# EAGLE design boarduino_clone (EAGLE 9.5.2)
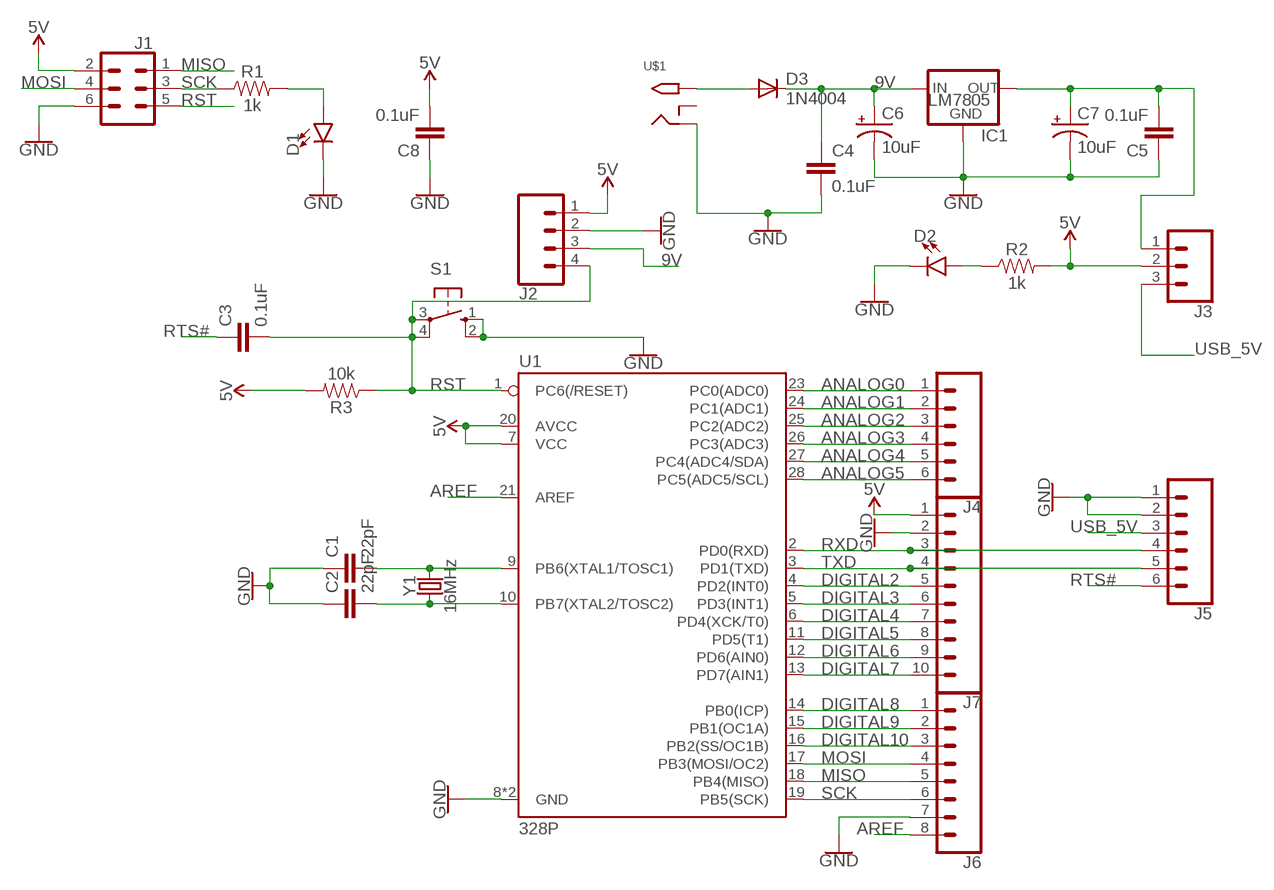
[diagram p0: schematic, sheet 1]

## Parts
C1  22pF  22PF-PTH-2.54MM-200V-5%  [CAP-PTH-2.54]
C2  22pF  22PF-PTH-2.54MM-200V-5%  [CAP-PTH-2.54]
C3  0.1uF  0.1UF-KIT-EZ-50V-20%  [CAP-PTH-SMALL-KIT]
C4  0.1uF  0.1UF-KIT-EZ-50V-20%  [CAP-PTH-SMALL-KIT]
C5  0.1uF  0.1UF-KIT-EZ-50V-20%  [CAP-PTH-SMALL-KIT]
C6  10uF  10UF-POLAR-RADIAL-2.5MM-25V-20%  [CPOL-RADIAL-2.5MM-5MM]
C7  10uF  10UF-POLAR-RADIAL-2.5MM-25V-20%  [CPOL-RADIAL-2.5MM-5MM]
C8  0.1uF  0.1UF-KIT-EZ-50V-20%  [CAP-PTH-SMALL-KIT]
D1  LED5MM  [LED_5MM]
D2  LED5MM  [LED_5MM]
D3  1N4004  [DO41-10]
IC1  LM7805  78XXS  [78XXS]
J1  FEMALE 2x3  CONN_03X2FEMALE  [2X3]
J2  CONN_041X04_NO_SILK  [1X04_NO_SILK]
J3  CONN_031X03_NO_SILK  [1X03_NO_SILK]
J4  CONN_06NO_SILK_FEMALE_PTH  [1X06_NO_SILK]
J5  CONN_06NO_SILK_FEMALE_PTH  [1X06_NO_SILK]
J6  CONN_08NO_SILK_FEMALE_PTH  [1X08_NO_SILK]
J7  CONN_10NO_SILK_PTH_FEMALE  [1X10_NO_SILK]
R1  1k  1KOHM-VERT-1/4W-5%  [AXIAL-0.1]
R2  1k  1KOHM-VERT-1/4W-5%  [AXIAL-0.1]
R3  10k  10KOHM-VERT-1/4W-5%  [AXIAL-0.1]
S1  10-XX  [B3F-10XX]
U1  328P  ATMEGA328P_PDIP  [DIP28]
U$1  2.1MMJACKTHM  [PJ-102A]
Y1  16MHz  CRYSTAL-16MHZPTH-HC49US  [HC49US]

## Nets
5V: C8.2 J1.2 J2.1 J3.2 J7.1 R2.P$2 R3.P$2 U1.7(VCC) U1.20(AVCC)
9V: C4.1 C6.1(+) D3.C IC1.IN J2.3
ANALOG0: J4.1 U1.23(PC0(ADC0))
ANALOG1: J4.2 U1.24(PC1(ADC1))
ANALOG2: J4.3 U1.25(PC2(ADC2))
ANALOG3: J4.4 U1.26(PC3(ADC3))
ANALOG4: J4.5 U1.27(PC4(ADC4/SDA))
ANALOG5: J4.6 U1.28(PC5(ADC5/SCL))
AREF: J6.8 U1.21(AREF)
DIGITAL2: J7.5 U1.4(PD2(INT0))
DIGITAL3: J7.6 U1.5(PD3(INT1))
DIGITAL4: J7.7 U1.6(PD4(XCK/T0))
DIGITAL5: J7.8 U1.11(PD5(T1))
DIGITAL6: J7.9 U1.12(PD6(AIN0))
DIGITAL7: J7.10 U1.13(PD7(AIN1))
DIGITAL8: J6.1 U1.14(PB0(ICP))
DIGITAL9: J6.2 U1.15(PB1(OC1A))
DIGITAL10: J6.3 U1.16(PB2(SS/OC1B))
GND: C1.1 C2.1 C4.2 C5.1 C6.2(-) C7.2(-) C8.1 D1.K(C) D2.K(C) IC1.GND J1.6 J2.2 J5.1 J5.2 J6.7 J7.2 S1.1(S) S1.2(S1) U1.8(GND) U1.22(GND) U$1.RING
MISO: J1.1 J6.5 U1.18(PB4(MISO))
MOSI: J1.4 J6.4 U1.17(PB3(MOSI/OC2))
N$6: D1.A R1.P$2
N$12: C1.2 U1.9(PB6(XTAL1/TOSC1)) Y1.2
N$13: C2.2 U1.10(PB7(XTAL2/TOSC2)) Y1.1
N$36: D3.A U$1.TIP
N$40: C5.2 C7.1(+) IC1.OUT J3.1
N$46: D2.A R2.P$1
RST: C3.2 J1.5 J2.4 R3.P$1 S1.3(P) S1.4(P1) U1.1(PC6(/RESET))
RTS#: C3.1 J5.6
RXD: J5.4 J7.3 U1.2(PD0(RXD))
SCK: J1.3 J6.6 R1.P$1 U1.19(PB5(SCK))
TXD: J5.5 J7.4 U1.3(PD1(TXD))
USB_5V: J3.3 J5.3
Unconnected: U$1.RING_SW

## Library data of the parts
C1 C2 = SparkFun-Capacitors:22PF: 22pF ceramic capacitors A capacitor is a passive two-terminal electrical component used to store electrical energy temporarily in an electric field.; PROD_ID: CAP-09128
C3-C5 C8 = SparkFun-Capacitors:0.1UF: 0.1µF ceramic capacitors A capacitor is a passive two-terminal electrical component used to store electrical energy temporarily in an electric field.; PROD_ID: CAP-08370
C6 C7 = SparkFun-Capacitors:10UF-POLAR: 10.0µF polarized capacitors A capacitor is a passive two-terminal electrical component used to store electrical energy temporarily in an electric field.; PROD_ID: CAP-08440
D1 D2 = SparkFun-LED:LED: LED (Generic) Standard schematic elements and footprints for 5mm, 3mm, 1206, and 0603 sized LEDs. Generic LEDs with no color specified.
D3 = adafruit:1N4004: DIODE General purpose 1N400x type rectifier (With bigger pads) http://www.ladyada.net/library/pcb/eaglelibrary.html
IC1 = v-reg:78XXS: VOLTAGE REGULATOR
J1 = SparkFun-Connectors:CONN_03X2: Multi connection point. Often used as Generic Header-pin footprint for 0.1 inch spaced/style header connections You can populate with any combo of single row headers, but if you'd like an exact match, check these: Header - 2x3 (Male, 0.1") <https://www.sparkfun.com/products/12807> (PRT-12807) Header - 2x3 (Female, 0.1") <https://www.sparkfun.com/products/13010> (PRT-13010) 2x3 Pin Shrouded Header <https://www.sparkfun.com/products/10877> (PRT-10877) On any of the 0.1 inch spaced packages, you can populate with these: Break Away Headers - Straight <https://www.sparkfun.com/products/116> (PRT-00116) Break Away Male Headers - Right Angle <https://www.sparkfun.com/products/553> (PRT-00553) Female Headers <https://www.sparkfun.com/products/115> (PRT-00115) Break Away Headers - Machine Pin <https://www.sparkfun.com/products/117> (PRT-00117) Break Away Female Headers - Swiss Machine Pin <https://www.sparkfun.com/products/743> (PRT-00743) Special note: the shrouded connector mates well with our 3x2 ribbon cables: Ribbon Crimp Connector - 6-pin (2x3, Female) <https://www.sparkfun.com/products/10651> (PRT-10651) Ribbon Cable - 6 wire (15ft) <https://www.sparkfun.com/products/10646> (PRT-10646); PROD_ID: CONN-11566
J2 = SparkFun-Connectors:CONN_04: Multi connection point. Often used as Generic Header-pin footprint for 0.1 inch spaced/style header connections On any of the 0.1 inch spaced packages, you can populate with these: Break Away Headers - Straight <https://www.sparkfun.com/products/116> (PRT-00116) Break Away Male Headers - Right Angle <https://www.sparkfun.com/products/553> (PRT-00553) Female Headers <https://www.sparkfun.com/products/115> (PRT-00115) Break Away Headers - Machine Pin <https://www.sparkfun.com/products/117> (PRT-00117) Break Away Female Headers - Swiss Machine Pin <https://www.sparkfun.com/products/743> (PRT-00743) For SCREWTERMINALS and SPRING TERMINALS visit here: Screw Terimnals on SparkFun.com <https://www.sparkfun.com/search/results?term=Screw+Terminals> (5mm/3.5mm/2.54mm spacing) This device is also useful as a general connection point to wire up your design to another part of your project. Our various solder wires solder well into these plated through hole pads. Hook-Up Wire - Assortment (Stranded, 22 AWG) <https://www.sparkfun.com/products/11375> (PRT-11375) Hook-Up Wire - Assortment (Solid Core, 22 AWG) <https://www.sparkfun.com/products/11367> (PRT-11367) View the entire wire category on our website here <https://www.sparkfun.com/categories/141> Special notes: Molex polarized connector foot print use with SKU : PRT-08231 with associated crimp pins and housings. 1MM SMD Version SKU: PRT-10208; PROD_ID: CONN-09696
J3 = SparkFun-Connectors:CONN_03: Multi connection point. Often used as Generic Header-pin footprint for 0.1 inch spaced/style header connections On any of the 0.1 inch spaced packages, you can populate with these: Break Away Headers - Straight <https://www.sparkfun.com/products/116> (PRT-00116) Break Away Male Headers - Right Angle <https://www.sparkfun.com/products/553> (PRT-00553) Female Headers <https://www.sparkfun.com/products/115> (PRT-00115) Break Away Headers - Machine Pin <https://www.sparkfun.com/products/117> (PRT-00117) Break Away Female Headers - Swiss Machine Pin <https://www.sparkfun.com/products/743> (PRT-00743) Stackable Header - 3 Pin (Female, 0.1") <https://www.sparkfun.com/products/13875> (PRT-13875) For SCREWTERMINALS and SPRING TERMINALS visit here: Screw Terimnals on SparkFun.com <https://www.sparkfun.com/search/results?term=Screw+Terminals> (5mm/3.5mm/2.54mm spacing) This device is also useful as a general connection point to wire up your design to another part of your project. Our various solder wires solder well into these plated through hole pads. Hook-Up Wire - Assortment (Stranded, 22 AWG) <https://www.sparkfun.com/products/11375> (PRT-11375) Hook-Up Wire - Assortment (Solid Core, 22 AWG) <https://www.sparkfun.com/products/11367> (PRT-11367) View the entire wire category on our website here <https://www.sparkfun.com/categories/141> Special notes: Molex polarized connector foot print use with SKU : PRT-08232 with associated crimp pins and housings.
J4 J5 = SparkFun-Connectors:CONN_06: Multi connection point. Often used as Generic Header-pin footprint for 0.1 inch spaced/style header connections On any of the 0.1 inch spaced packages, you can populate with these: Break Away Headers - Straight <https://www.sparkfun.com/products/116> (PRT-00116) Break Away Male Headers - Right Angle <https://www.sparkfun.com/products/553> (PRT-00553) Female Headers <https://www.sparkfun.com/products/115> (PRT-00115) Break Away Headers - Machine Pin <https://www.sparkfun.com/products/117> (PRT-00117) Break Away Female Headers - Swiss Machine Pin <https://www.sparkfun.com/products/743> (PRT-00743) Arduino Stackable Header - 6 Pin <https://www.sparkfun.com/products/9280> (PRT-09280) For SCREWTERMINALS and SPRING TERMINALS visit here: Screw Terimnals on SparkFun.com <https://www.sparkfun.com/search/results?term=Screw+Terminals> (5mm/3.5mm/2.54mm spacing) This device is also useful as a general connection point to wire up your design to another part of your project. Our various solder wires solder well into these plated through hole pads. Hook-Up Wire - Assortment (Stranded, 22 AWG) <https://www.sparkfun.com/products/11375> (PRT-11375) Hook-Up Wire - Assortment (Solid Core, 22 AWG) <https://www.sparkfun.com/products/11367> (PRT-11367) View the entire wire category on our website here <https://www.sparkfun.com/categories/141>; PROD_ID: CONN-08437
J6 = SparkFun-Connectors:CONN_08: Multi connection point. Often used as Generic Header-pin footprint for 0.1 inch spaced/style header connections On any of the 0.1 inch spaced packages, you can populate with these: Break Away Headers - Straight <https://www.sparkfun.com/products/116> (PRT-00116) Break Away Male Headers - Right Angle <https://www.sparkfun.com/products/553> (PRT-00553) Female Headers <https://www.sparkfun.com/products/115> (PRT-00115) Break Away Headers - Machine Pin <https://www.sparkfun.com/products/117> (PRT-00117) Break Away Female Headers - Swiss Machine Pin <https://www.sparkfun.com/products/743> (PRT-00743) Arduino Stackable Header - 8 Pin <https://www.sparkfun.com/products/9279> (PRT-09279) For SCREWTERMINALS and SPRING TERMINALS visit here: Screw Terimnals on SparkFun.com <https://www.sparkfun.com/search/results?term=Screw+Terminals> (5mm/3.5mm/2.54mm spacing) This device is also useful as a general connection point to wire up your design to another part of your project. Our various solder wires solder well into these plated through hole pads. Hook-Up Wire - Assortment (Stranded, 22 AWG) <https://www.sparkfun.com/products/11375> (PRT-11375) Hook-Up Wire - Assortment (Solid Core, 22 AWG) <https://www.sparkfun.com/products/11367> (PRT-11367) View the entire wire category on our website here <https://www.sparkfun.com/categories/141> Special notes: Molex polarized connector foot print use with SKU : PRT-08231 with associated crimp pins and housings. 1MM SMD Version SKU: PRT-10208 NOTES ON THE VARIANTS LOCK and LOCK_LONGPADS... This footprint was designed to help hold the alignment of a through-hole component (i.e. 6-pin header) while soldering it into place. You may notice that each hole has been shifted either up or down by 0.005 of an inch from it's more standard position (which is a perfectly straight line). This slight alteration caused the pins (the squares in the middle) to touch the edges of the holes. Because they are alternating, it causes a "brace" to hold the component in place. 0.005 has proven to be the perfect amount of "off-center" position when using our standard breakaway headers. Although looks a little odd when you look at the bare footprint, once you have a header in there, the alteration is very hard to notice. Also,if you push a header all the way into place, it is covered up entirely on the bottom side.; PROD_ID: CONN-08438
J7 = SparkFun-Connectors:CONN_10: Multi connection point. Often used as Generic Header-pin footprint for 0.1 inch spaced/style header connections On any of the 0.1 inch spaced packages, you can populate with these: Break Away Headers - Straight <https://www.sparkfun.com/products/116> (PRT-00116) Break Away Male Headers - Right Angle <https://www.sparkfun.com/products/553> (PRT-00553) Female Headers <https://www.sparkfun.com/products/115> (PRT-00115) Break Away Headers - Machine Pin <https://www.sparkfun.com/products/117> (PRT-00117) Break Away Female Headers - Swiss Machine Pin <https://www.sparkfun.com/products/743> (PRT-00743) Arduino Stackable Header - 10 Pin <https://www.sparkfun.com/products/11376> (PRT-11376) For SCREWTERMINALS and SPRING TERMINALS visit here: Screw Terimnals on SparkFun.com <https://www.sparkfun.com/search/results?term=Screw+Terminals> (5mm/3.5mm/2.54mm spacing) This device is also useful as a general connection point to wire up your design to another part of your project. Our various solder wires solder well into these plated through hole pads. Hook-Up Wire - Assortment (Stranded, 22 AWG) <https://www.sparkfun.com/products/11375> (PRT-11375) Hook-Up Wire - Assortment (Solid Core, 22 AWG) <https://www.sparkfun.com/products/11367> (PRT-11367) View the entire wire category on our website here <https://www.sparkfun.com/categories/141> Special notes: Molex polarized connector foot print use with SKU : PRT-08231 with associated crimp pins and housings. 1MM SMD Version SKU: PRT-10208 NOTES ON THE VARIANTS LOCK and LOCK_LONGPADS... This footprint was designed to help hold the alignment of a through-hole component (i.e. 6-pin header) while soldering it into place. You may notice that each hole has been shifted either up or down by 0.005 of an inch from it's more standard position (which is a perfectly straight line). This slight alteration caused the pins (the squares in the middle) to touch the edges of the holes. Because they are alternating, it causes a "brace" to hold the component in place. 0.005 has proven to be the perfect amount of "off-center" position when using our standard breakaway headers. Although looks a little odd when you look at the bare footprint, once you have a header in there, the alteration is very hard to notice. Also,if you push a header all the way into place, it is covered up entirely on the bottom side.
R1 R2 = SparkFun-Resistors:1KOHM: 1kΩ resistor A resistor is a passive two-terminal electrical component that implements electrical resistance as a circuit element. Resistors act to reduce current flow, and, at the same time, act to lower voltage levels within circuits. - Wikipedia; PROD_ID: RES-08380
R3 = SparkFun-Resistors:10KOHM: 10kΩ resistor A resistor is a passive two-terminal electrical component that implements electrical resistance as a circuit element. Resistors act to reduce current flow, and, at the same time, act to lower voltage levels within circuits. - Wikipedia; PROD_ID: RES-09435
S1 = switch-omron:10-XX: OMRON SWITCH; MPN: B3F-1000; OC_FARNELL: 176432; OC_NEWARK: 36M3542
U1 = SparkFun-IC-Microcontroller:ATMEGA328P_PDIP: Atmel 328P Through hole ATMEGA328P uC used in the Arduino 32kb flash, 1k EEPROM, 2k SRAM Datasheet <http://www.sparkfun.com/datasheets/Components/SMD/ATMega328.pdf> SparkFun Products Storefront component: AVR 28 Pin 20MHz 32K 6A/D - ATMega328P <https://www.sparkfun.com/products/9061> (COM-09061) SparkFun Simon Says - Through-Hole Soldering Kit <https://www.sparkfun.com/products/10547> (KIT-10547) SparkFun Learn to Solder - Simon Says <https://www.sparkfun.com/products/13708> (KIT-13708) SparkFun BigTime Watch Kit <https://www.sparkfun.com/products/11734> (KIT-11734) SparkFun ClockIt <https://www.sparkfun.com/products/10930> (KIT-10930) SparkFun Serial Enabled LCD Kit <https://www.sparkfun.com/products/10097> (LCD-10097) SparkFun Simon Tilts - Through Hole Soldering Kit <https://www.sparkfun.com/products/12634> (KIT-12634) SparkFun Frequency Counter Kit <https://www.sparkfun.com/products/10140> (KIT-10140) FabFM Radio Kit <https://www.sparkfun.com/products/11043> (KIT-11043) SparkFun Binary Blaster Kit <https://www.sparkfun.com/products/12037> (KIT-12037) SparkFun Metro-Gnome <https://www.sparkfun.com/products/9236> (KIT-09236) ATmega328 with Arduino Optiboot (Uno) <https://www.sparkfun.com/products/10524> (DEV-10524); PROD_ID: IC-09136
U$1 = adafruit:2.1MMJACK: 2.1mm x 5.5mm THM DC jack with internal switch. Digikey part #PJ-102A, 4UCON part #05537 2.1mm x 5.5mm SMT DC jack with internal switch. Digikey part #PJ-002A-SMT, 4UCON part #03267 By microbuilder.eu & adafruit.com
Y1 = SparkFun-Clocks:CRYSTAL-16MHZ: 16MHz Crystal Digikey Example <http://www.digikey.com/product-search/en?keywords=535-9122-1-ND> Frequency: 16MHz Frequency Stability: ±50ppm Frequency Tolerance: ±20ppm Load Capacitance: 18pF SparkFun Products: Pro Micro -5V/16MHz <https://www.sparkfun.com/products/12640> SparkFun Serial Enabled LCD Kit <https://www.sparkfun.com/products/10097>; PROD_ID: XTAL-08181; SF_ID: COM-00536

## Board
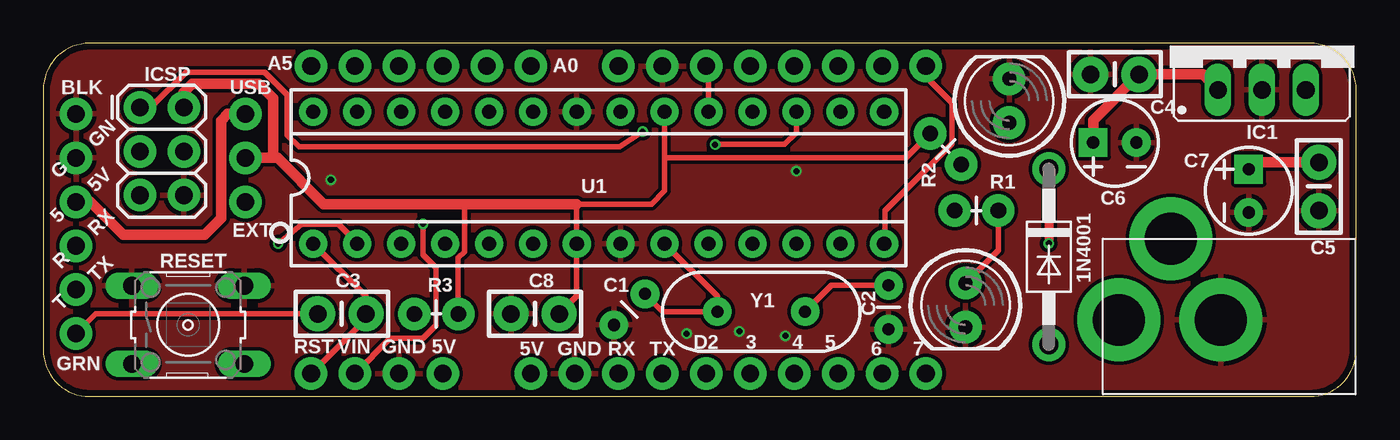
[diagram p1: board, top side]
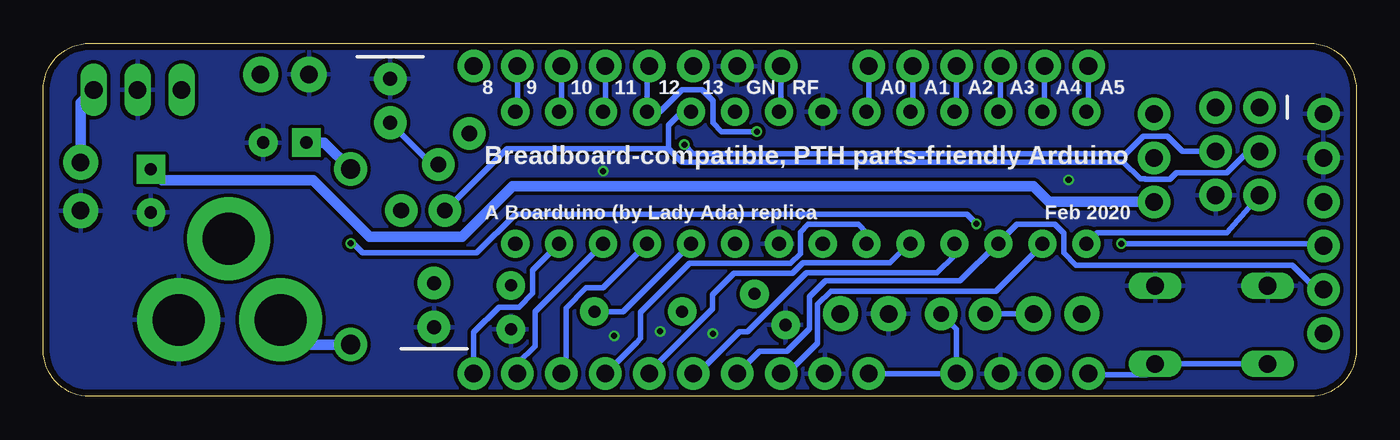
[diagram p2: board, bottom side, seen from below]

Size 75.95 x 20.42 mm. Coordinates in mm from the lower left corner, seen from the top.
Outline: 2.68,0 73.27,0 arc90 75.95,2.68 75.95,17.74 arc90 73.27,20.42 2.68,20.42 arc90 0,17.74 0,2.68 arc90 2.68,0
Copper layers (1*16): Top 0.035559375mm / dielectric 1.6mm / Bottom 0.035559375mm
Design rules "oshpark-2layer": minimum track width 6mil, minimum drill 10mil, track to track 6mil, track to pad 6mil, pad to pad 6mil, via to via 6mil, smd to smd 6mil, copper to edge 15mil, drill to drill 6mil, minimum pad ring 5mil, minimum via ring 5mil, stop-mask expansion 2.5mil, vias tented up to drill 0mil, thermal gap 10mil

### Footprints (pad centres in the part's own frame; a part is rotated, then mirrored left to right if it is on the bottom)
CAP-PTH-2.54 = drill 0.7 pad 1.651: 1 -1.27,0; 2 1.27,0
CAP-PTH-SMALL-KIT = drill 1.016 pad 2.032: 1 -1.397,0; 2 1.397,0
CPOL-RADIAL-2.5MM-5MM = drill 0.7 pad 1.651 square: 1 1.25,0 | drill 0.7 pad 1.651: 2 -1.25,0
LED_5MM = drill 0.813 pad 1.88: A -1.27,0; K 1.27,0
DO41-10 = drill 1.118 pad 1.93: A 5.08,0; C -5.08,0
78XXS = drill 1.016 long: GND 0,-2.54; IN -2.54,-2.54; OUT 2.54,-2.54
2X3 = drill 1.016 pad 1.88: 1 0,0; 2 0,2.54; 3 2.54,0; 4 2.54,2.54; 5 5.08,0; 6 5.08,2.54
1X04_NO_SILK = drill 1.016 pad 1.88: 1 0,0; 2 2.54,0; 3 5.08,0; 4 7.62,0
1X03_NO_SILK = drill 1.016 pad 1.88: 1 0,0; 2 2.54,0; 3 5.08,0
1X06_NO_SILK = drill 1.016 pad 1.88: 1 0,0; 2 2.54,0; 3 5.08,0; 4 7.62,0; 5 10.16,0; 6 12.7,0
1X08_NO_SILK = drill 1.016 pad 1.88: 1 0,0; 2 2.54,0; 3 5.08,0; 4 7.62,0; 5 10.16,0; 6 12.7,0; 7 15.24,0; 8 17.78,0
1X10_NO_SILK = drill 1.016 pad 1.88: 1 0,0; 2 2.54,0; 3 5.08,0; 4 7.62,0; 5 10.16,0; 6 12.7,0; 7 15.24,0; 8 17.78,0; 9 20.32,0; 10 22.86,0
AXIAL-0.1 = drill 0.9 pad 1.88: P$1 -1.27,0; P$2 1.27,0
B3F-10XX = drill 1.016 long: 1 -3.251,2.261; 2 3.251,2.261; 3 -3.251,-2.261; 4 3.251,-2.261
DIP28 = drill 0.813 pad 1.626: 1 -16.51,-3.81; 2 -13.97,-3.81; 3 -11.43,-3.81; 4 -8.89,-3.81; 5 -6.35,-3.81; 6 -3.81,-3.81; 7 -1.27,-3.81; 8 1.27,-3.81; 9 3.81,-3.81; 10 6.35,-3.81; 11 8.89,-3.81; 12 11.43,-3.81; 13 13.97,-3.81; 14 16.51,-3.81; 15 16.51,3.81; 16 13.97,3.81; 17 11.43,3.81; 18 8.89,3.81; 19 6.35,3.81; 20 3.81,3.81; 21 1.27,3.81; 22 -1.27,3.81; 23 -3.81,3.81; 24 -6.35,3.81; 25 -8.89,3.81; 26 -11.43,3.81; 27 -13.97,3.81; 28 -16.51,3.81
PJ-102A = drill 3 pad 4.8: RING 0.1,-3.39; RING_SW -4.6,-6.29; TIP 0.1,-9.29
HC49US = drill 0.7 pad 1.651: 1 -2.54,0; 2 2.54,0

### Placement (x,y rotation side)
C1  33.91,5.03 45 top
C2  48.9,5.16 90 top
C3  17.27,4.78 0 top
C4  61.98,18.62 180 top
C5  73.79,12.14 90 top
C6  61.98,14.68 180 top
C7  69.72,11.89 90 top
C8  28.45,4.78 0 top
D1  53.34,5.28 270 top
D2  55.88,17.09 90 top
D3  58.17,8.08 270 top
IC1  70.48,20.27 0 top
J1  5.59,16.71 270 top
J2  23.11,1.32 180 top
J3  11.68,11.25 90 top
J4  28.19,19.1 180 top
J5  1.91,16.33 270 top
J6  51.05,19.1 180 top
J7  28.19,1.32 0 top
R1  53.98,10.74 0 top
R2  52.2,14.3 135 top
R3  22.73,4.78 0 top
S1  8.38,4.14 0 top
U1  32.13,12.65 0 top
U$1  71.5,4.52 270 top
Y1  41.53,4.9 180 top

### Tracks (layer width: path | path; a pad name or v marks a point on that pad's centre or on a via)
5V
  Top 0.305: R3.P$2 24,8.02 24.36,8.38 24.36,11.1 24.38,11.13 | 35.94,13.79 35.94,11.89 35.18,11.13 30.86,11.13 U1.7 30.86,5.79 C8.2 | 35.94,13.79 U1.20 | R2.P$2 49.89,13.79 35.94,13.79
  Top 0.61: J3.2 13.31,13.79 | 13.31,13.79 13.56,13.79 16.23,11.13 24.38,11.13 30.86,11.13 | 13.31,13.79 13.31,17.23 12.45,18.09 8.61,18.09 8.13,17.6 J1.2
  Bottom 0.305: R3.P$2 23.11,3.89 J2.1 J7.1
9V  (via drill 0.35)
  Top 0.305: J2.3 20.07,3.35 21.97,3.35 22.73,4.12 22.73,7.44 21.97,8.2 v21.97,9.98
  Top 0.508: D3.C 58.15,13.14 v58.15,8.85
  Top 0.61: C6.1 60.73,15.97 C4.1 67.06,18.62 IC1.IN
  Bottom 0.305: v21.97,9.98 22.53,10.54 48.64,10.54 50.87,8.31 57.48,8.31 58.03,8.85 v58.15,8.85
  Bottom 0.61: C6.1 59.69,14.68 D3.C
ANALOG0
  Bottom 0.305: J4.1 28.19,16.59 U1.23
ANALOG1
  Bottom 0.305: J4.2 25.65,16.59 U1.24
ANALOG2
  Bottom 0.305: J4.3 23.11,16.59 U1.25
ANALOG3
  Bottom 0.305: J4.4 20.57,16.59 U1.26
ANALOG4
  Bottom 0.305: J4.5 18.03,16.59 U1.27
ANALOG5
  Bottom 0.305: J4.6 15.49,16.59 U1.28
AREF
  Bottom 0.305: J6.8 33.27,16.59 U1.21
DIGITAL2
  Bottom 0.305: U1.4 23.24,8.15 24.25,7.14 31.8,7.14 35.2,3.73 35.69,3.73 38.1,1.32 J7.5
DIGITAL3
  Bottom 0.305: U1.5 25.85,8.84 26.97,7.72 31.99,7.72 32.6,7.11 35.99,7.11 37.22,5.88 37.22,5.07 40.89,1.4 J7.6
DIGITAL4
  Bottom 0.305: U1.6 28.32,9.47 28.8,9.96 31.7,9.96 32.16,9.51 32.16,8.25 32.71,7.69 38.56,7.69 41.39,4.86 41.39,3.37 41.64,3.11 J7.7
DIGITAL5
  Bottom 0.305: U1.11 43.57,6.29 44.54,6.29 45.72,5.1 45.72,1.58 J7.8
DIGITAL6
  Bottom 0.305: U1.12 47.51,4.89 47.51,2.91 48.51,1.91 J7.9
DIGITAL7
  Bottom 0.305: U1.13 47.64,7.3 47.64,5.96 48.43,5.17 49.59,5.17 51.05,3.71 J7.10
DIGITAL8
  Top 0.305: J6.1 51.05,18.47 52.55,16.98 52.55,14.62 48.68,10.74 48.68,8.87 U1.14
DIGITAL9
  Bottom 0.305: J6.2 48.51,16.59 U1.15
DIGITAL10
  Bottom 0.305: J6.3 45.97,16.59 U1.16
GND  (via drill 0.35)
  other vias: 37.21,3.63 40.26,3.76 42.93,3.51 43.56,13.03 16.64,12.52
  pour Top (isolate 0.203): -1.52,-1.7 -1.52,22.05 77.47,22.05 77.47,-1.7
  pour Bottom (isolate 0.203): -0.51,-0.69 -0.51,21.16 76.58,21.16 76.58,-0.69
MISO  (via drill 0.35)
  Top 0.305: J1.1 6.22,16.71 8.25,18.75 12.82,18.75 14.12,17.44 14.12,15.11 14.8,14.43 33.34,14.43 v34.67,15.32
  Bottom 0.305: J6.5 41.02,18.97 U1.18 40.26,16.46 38.99,17.73 37.85,17.73 37.21,17.09 37.21,15.82 36.7,15.32 v34.67,15.32
MOSI  (via drill 0.35)
  Top 0.305: v38.86,14.55 39.06,14.58 42.88,14.58 43.56,15.26 U1.17
  Bottom 0.305: J6.4 43.43,16.59 U1.17 | v38.86,14.55 38.35,14.05 13.32,14.05 12.33,15.04 10.91,15.04 10.05,14.17 J1.4
N$6
  Top 0.305: R1.P$2 55.24,8.46 D1.A
N$12
  Top 0.305: C1.2 35.83,4.9 Y1.2 38.99,5.79 U1.9
N$13
  Top 0.305: Y1.1 45.59,6.43 C2.2
  Bottom 0.305: U1.10 42.42,4.9 Y1.1
N$36
  Bottom 0.61: U$1.TIP 60.79,3 D3.A
N$40
  Top 0.61: C7.1 70.12,13.54 C5.2
  Bottom 0.61: J3.1 17.78,11.25 18.67,12.14 48.79,12.14 51.71,9.22 57.08,9.22 60.34,12.49 69.07,12.49 C7.1 | IC1.OUT 73.79,16.97 C5.2
N$46
  Bottom 0.305: D2.A 53.46,13.4 R2.P$1
RST
  Top 0.305: U1.1 18.67,5.79 C3.2 18.67,4.5 J2.4
  Bottom 0.305: S1.3 S1.4 12.14,1.24 15.42,1.24 J2.4 | R3.P$1 C3.2 | J1.5 7.49,9.47 14.99,9.47 U1.1
RTS#
  Top 0.305: J5.6 3.05,4.78 C3.1
RXD  (via drill 0.35)
  Top 0.305: U1.2 18.16,8.9 17.1,9.96 14.96,9.96 v13.59,8.84
  Bottom 0.305: U1.2 18.16,8.78 20.85,6.1 30.39,6.1 31.17,5.32 31.17,3.07 32.92,1.32 J7.3 | v13.59,8.84 2.03,8.84 J5.4
SCK
  Top 0.305: J6.6 38.48,18.97 U1.19
  Bottom 0.305: U1.19 38.99,16.46 39.78,15.67 39.78,14.33 | J1.3 6.24,14.17 7.49,12.93 10.41,12.93 10.79,12.55 12.2,12.55 12.23,12.57 12.5,12.57 13.46,13.54 38.99,13.54 39.78,14.33 | R1.P$1 49.12,14.33 39.78,14.33
TXD
  Bottom 0.305: J5.5 2.29,6.17 3.71,7.59 16.21,7.59 16.92,8.3 16.92,9.43 17.44,9.96 19.64,9.96 20.7,8.9 U1.3 20.77,8.84 22.93,6.68 30.71,6.68 31.62,5.77 31.62,3.92 32.93,2.62 34.52,2.62 J7.4
USB_5V
  Top 0.61: J3.3 10.67,16.33 10.29,15.95 10.29,10.29 9.34,9.35 4.63,9.35 2.72,11.25 J5.3

### Text on the board
tPlace: A5 | A0 | BLK | ICSP | USB | C4 | IC1 | GN | R2 | C7 | G | 5V | U1 | R1 | C6 | 5 | RX | EXT | RESET | C5 | R | TX | 1N4001 | C3 | R3 | C8 | C1 | T | Y1 | C2 | RST | VIN | GND | 5V | D2 | 3 | 4 | 5 | GRN | 5V | GND | RX | TX | 6 | 7
bPlace: A5 | A4 | A3 | A2 | A1 | A0 | RF | GN | 13 | 12 | 11 | 10 | 9 | 8 | Breadboard-compatible, PTH parts-friendly Arduino | Feb 2020 | A Boarduino (by Lady Ada) replica